# Altium schematic sheet 08_MSM8916_RF.SchDoc
size A0
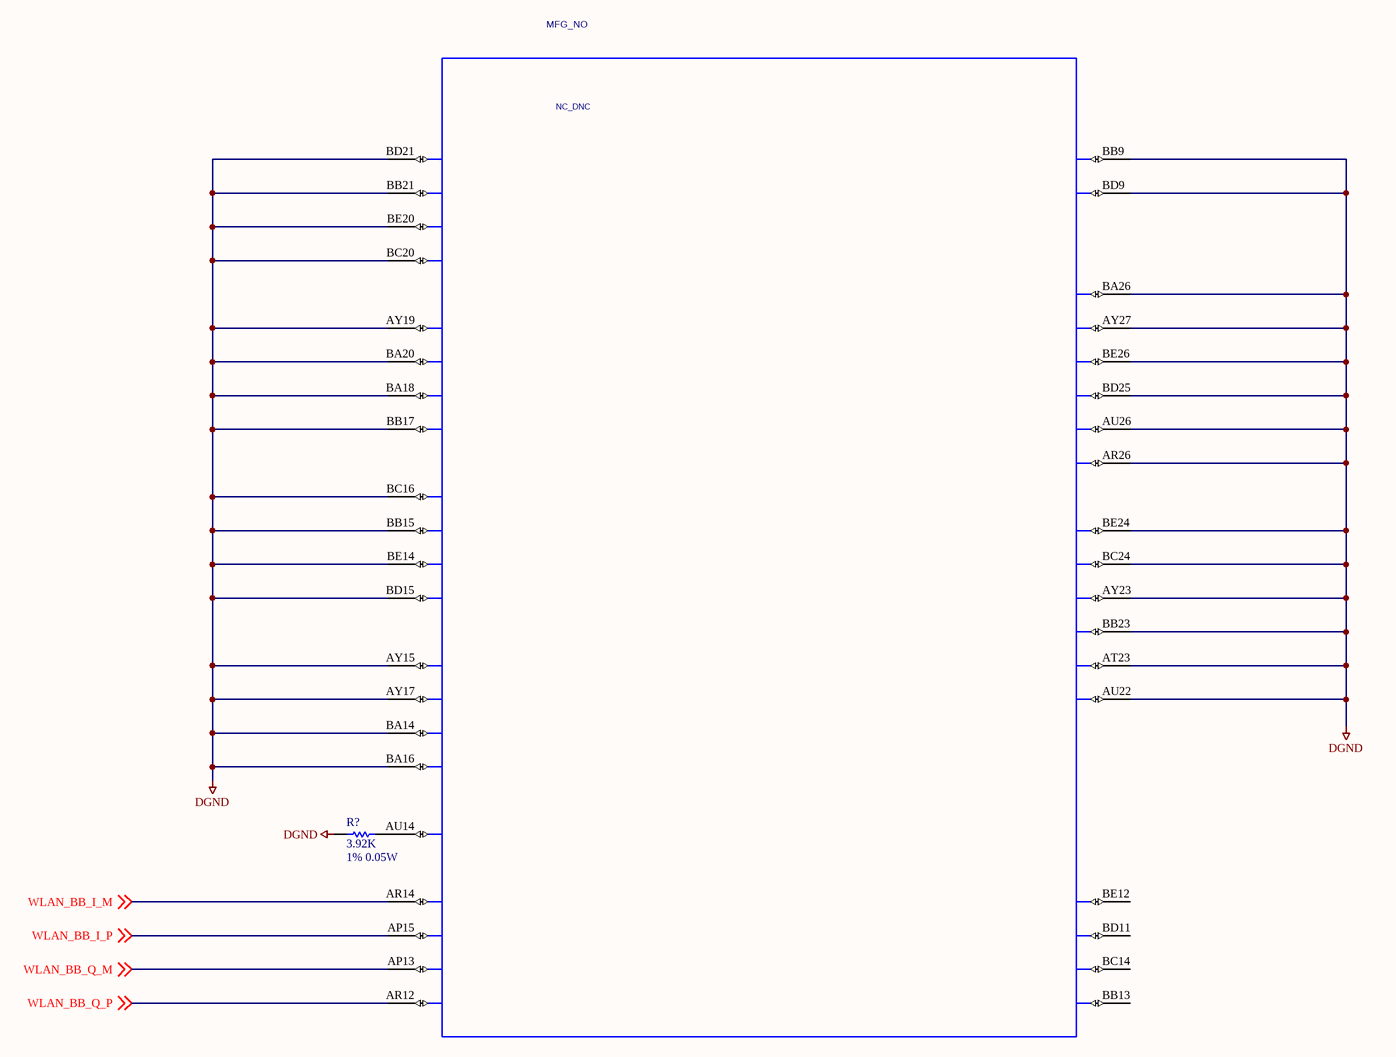
[diagram p0: 08_MSM8916_RF.SchDoc]

## Parts
R?  3.92K  value 1% 0.05W  [AXIAL-0.3]
U1  SYMNAME: NC_DNC  PART_ID: MFG_NO  [MSM-8916-0-760NSP-TR-00-0]  (hidden comment: ASIC_MSM8936_760PIN)  (part F of 13)

## Nets
DGND: R?.1 U1.AR26(TXDAC0_VREF) U1.AT23(TXDAC1_IREF) U1.AU22(TXDAC1_VREF) U1.AU26(TXDAC0_IREF) U1.AY15(BBRX1) U1.AY17(BBRX2) U1.AY19(BBRX_I_IN_CH1) U1.AY23(TXDAC1_QM) U1.AY27(TXDAC0_IP) U1.BA14(BBRX3) U1.BA16(BBRX4) U1.BA18(BBRX_I_QN_CH1) U1.BA20(BBRX_I_IP_CH1) U1.BA26(TXDAC0_IM) U1.BB9(GRFC1) U1.BB15(BBRX_I_IP_CH2) U1.BB17(BBRX_I_QP_CH1) U1.BB21(BBRX_I_IP_CH0) U1.BB23(TXDAC1_QP) U1.BC16(BBRX_I_IN_CH2) U1.BC20(BBRX_I_QP_CH0) U1.BC24(TXDAC1_IP) U1.BD9(GRFC2) U1.BD15(BBRX_I_QP_CH2) U1.BD21(BBRX_I_IN_CH0) U1.BD25(TXDAC0_QP) U1.BE14(BBRX_I_QN_CH2) U1.BE20(BBRX_I_QN_CH0) U1.BE24(TXDAC1_IM) U1.BE26(TXDAC0_QM)
WLAN_BB_I_M: U1.AR14(WLAN_IN) ; off-sheet WLAN_BB_I_M
WLAN_BB_I_P: U1.AP15(WLAN_IP) ; off-sheet WLAN_BB_I_P
WLAN_BB_Q_M: U1.AP13(WLAN_QN) ; off-sheet WLAN_BB_Q_M
WLAN_BB_Q_P: U1.AR12(WLAN_QP) ; off-sheet WLAN_BB_Q_P
NetR?_2: R?.2 U1.AU14(WLAN_RSET)

Not connected (* = marked no-connect by the designer): U1 BB13(GPS_BBQ2) BC14(GPS_BBQ) BD11(GPS_BBI2) BE12(GPS_BBI)

## Library data of the parts
R? = Res1: Resistor; Published: 8-Jun-2000; LatestRevisionDate: 17-Jul-2002; LatestRevisionNote: Re-released for DXP Platform.; PackageReference: AXIAL-0.3; Publisher: Altium Limited; PackageDescription: Axial Device, Thru-Hole; 2 Leads; 0.3 in Pin Spacing
U1 = ASIC_MSM8936_760PIN: PART_NUMBER: MCN_NO; OriginalSymbolOrigin: (-1100,2500); SPLIT_INST: TRUE; CDS_LMAN_SYM_OUTLINE: -1050,2500,1050,-2500; CDS_LMAN_SPLIT_NUMBER: 1 of 13; PACK_TYPE: ?